# EasyEDA Pro project F103_RGB.eprj, schematic Schematic1
Board Name: Board1; Create Date: 2025-01-08; Page Name: P1; Project Name: F103_RGB; Schematic Name: Schematic1; Update Date: 2025-01-13; Company: 嘉立创EDA; Page Size: A4; Version: V1.0
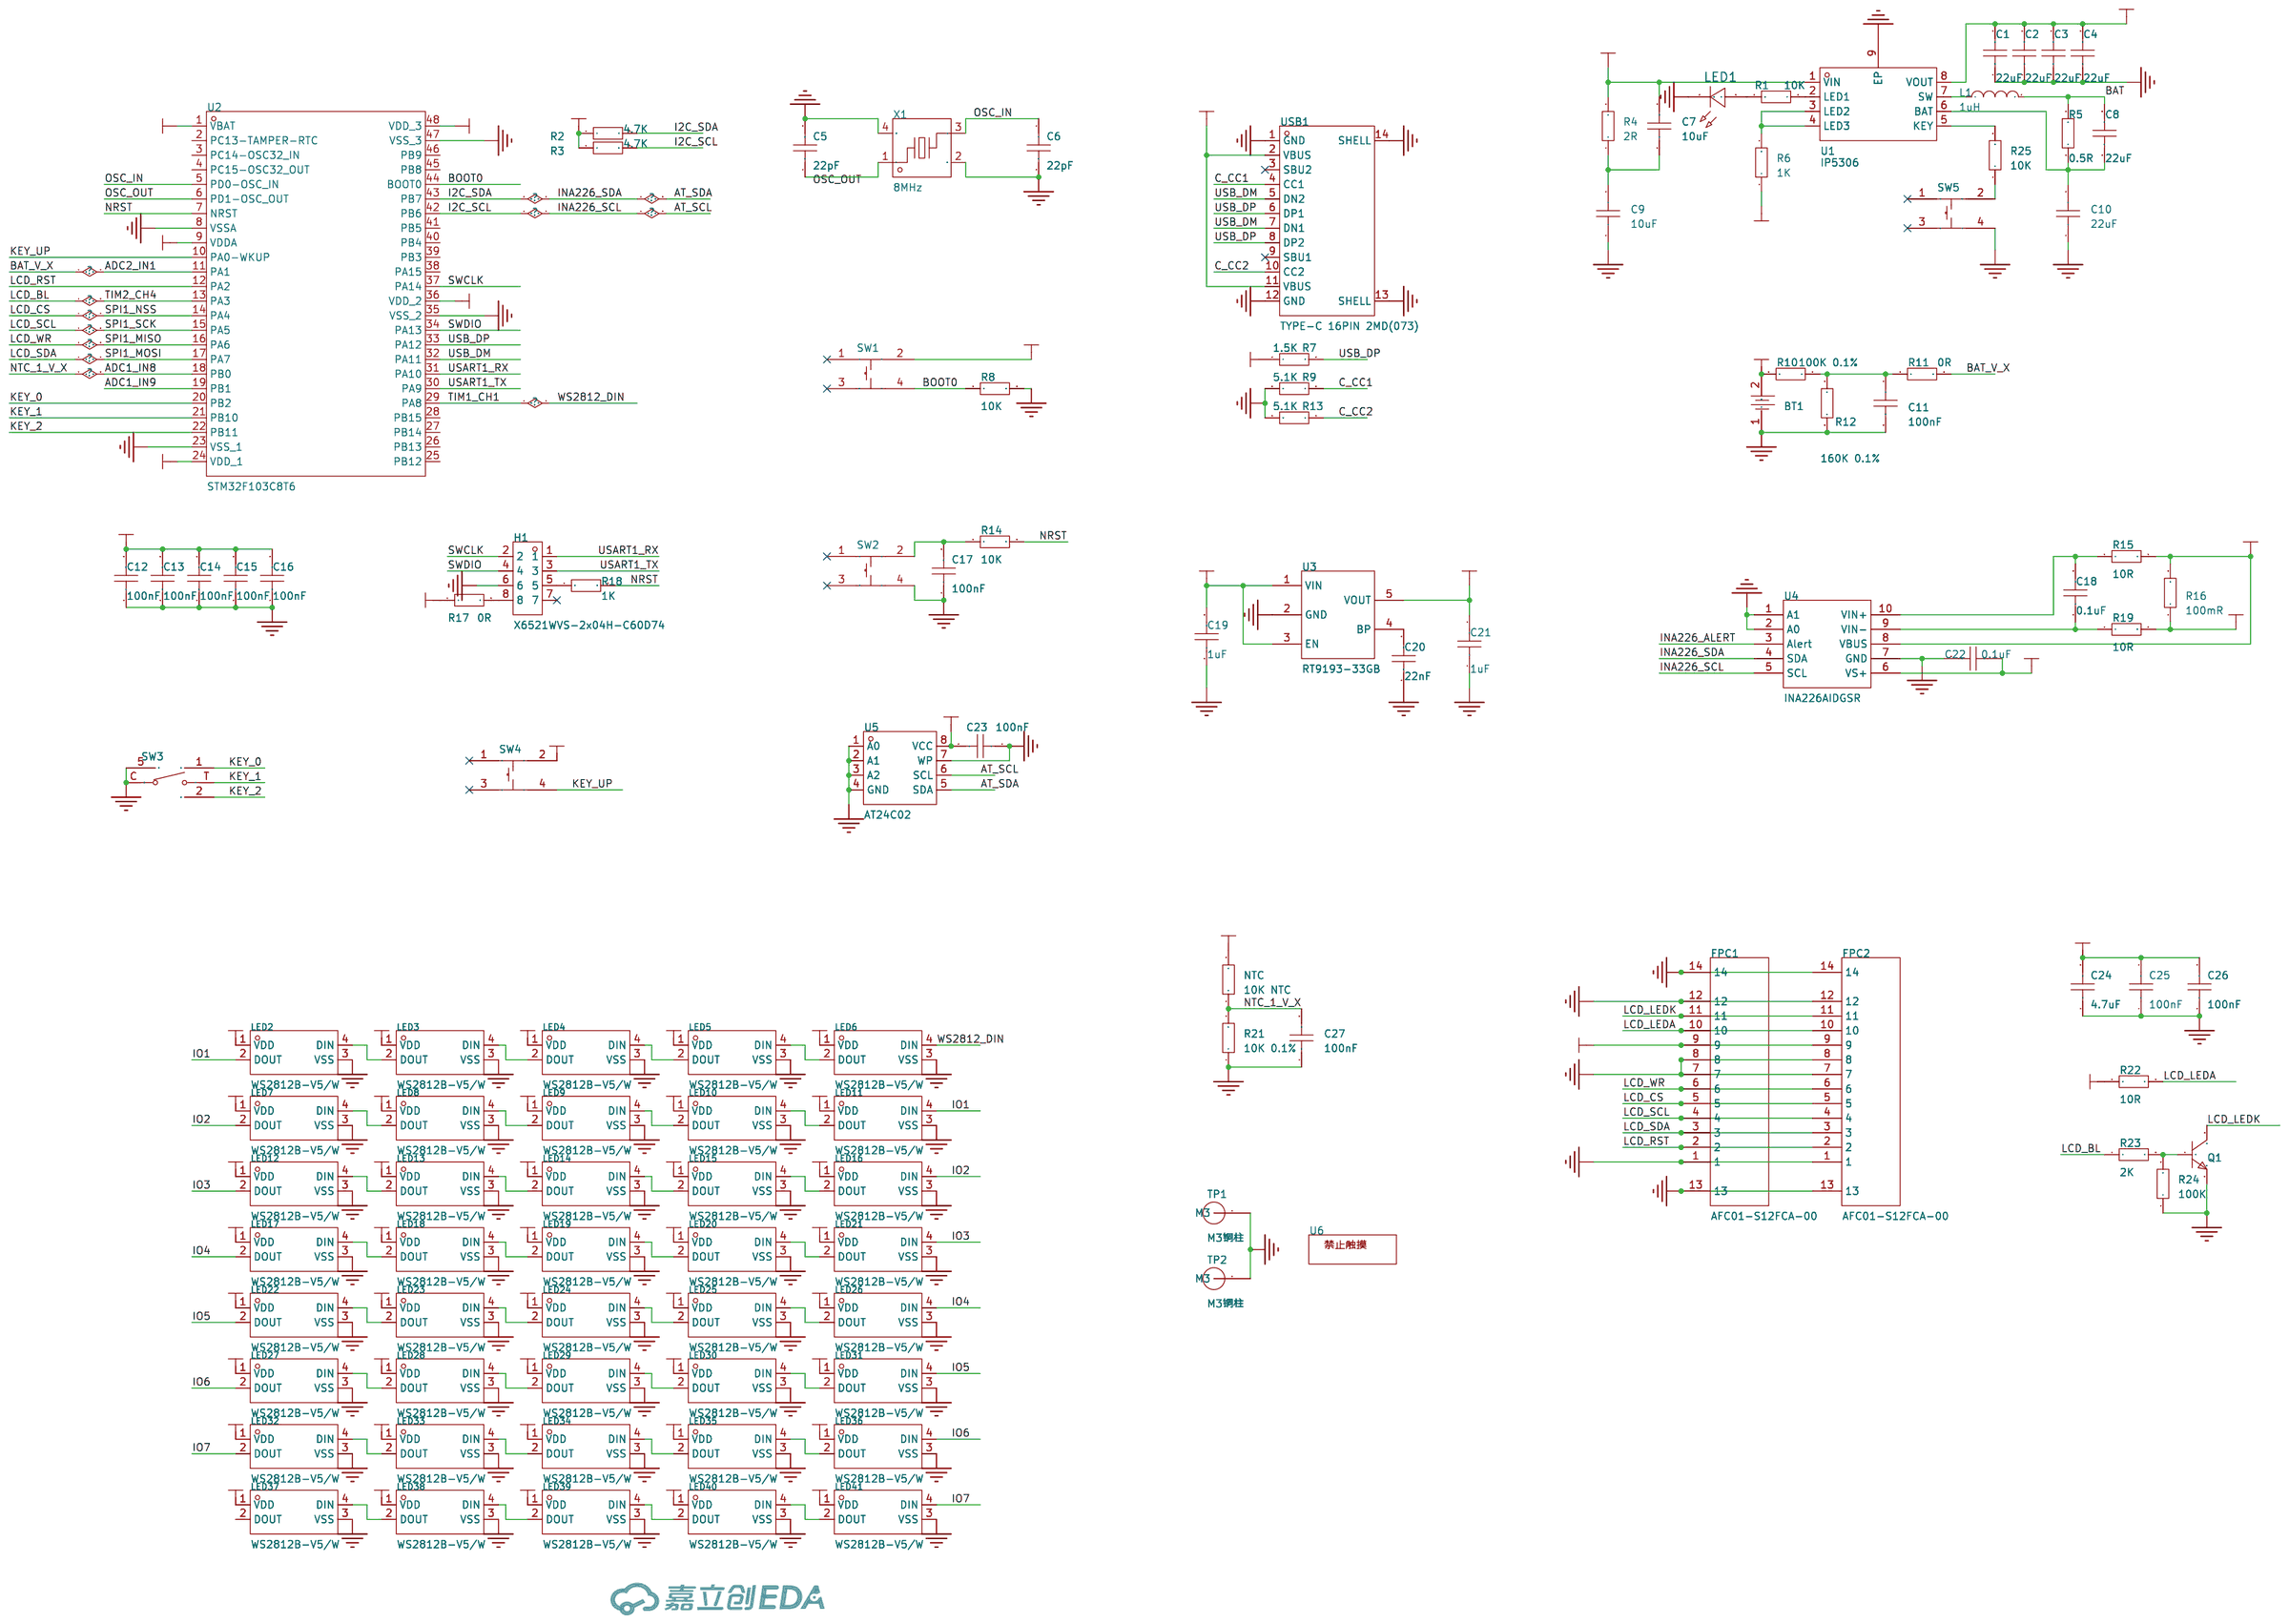
[diagram p0: schematic sheet]

## Parts
BT1  BH-18650-B1BA002  [BATTERY-SMD_18650-1S-L77.1-W20.7-1]
C1  22uF  [C0805]
C2  22uF  [C0805]
C3  22uF  [C0805]
C4  22uF  [C0805]
C5  22pF  [C0603]
C6  22pF  [C0603]
C7  10uF  [C0805]
C8  22uF  [C0805]
C9  10uF  [C0805]
C10  22uF  [C0805]
C11  100nF  [C0603]
C12  100nF  [C0603]
C13  100nF  [C0603]
C14  100nF  [C0603]
C15  100nF  [C0603]
C16  100nF  [C0603]
C17  100nF  [C0603]
C18  0.1uF  [C0603]
C19  1uF  [C0805]
C20  22nF  [C0603]
C21  1uF  [C0805]
C22  0.1uF  [C0603]
C23  100nF  [C0603]
C24  4.7uF  [C0603]
C25  100nF  [C0603]
C26  100nF  [C0603]
C27  100nF  [C0603]
FPC1  AFC01-S12FCA-00  [FPC-SMD_AFC01-S12FCA-00]
FPC2  AFC01-S12FCA-00  [FPC-SMD_AFC01-S12FCA-00]
H1  X6521WVS-2x04H-C60D74  [HDR-SMD_8P-P2.54-V-M-R2-C5-S7.4]
L1  1uH  [IND-SMD_L7.0-W7.0_HA63]
LED1  -  [LED_0603]
LED2  WS2812B-V5/W  [LED-SMD_4P-L5.0-W5.0-TL-1]
LED3  WS2812B-V5/W  [LED-SMD_4P-L5.0-W5.0-TL-1]
LED4  WS2812B-V5/W  [LED-SMD_4P-L5.0-W5.0-TL-1]
LED5  WS2812B-V5/W  [LED-SMD_4P-L5.0-W5.0-TL-1]
LED6  WS2812B-V5/W  [LED-SMD_4P-L5.0-W5.0-TL-1]
LED7  WS2812B-V5/W  [LED-SMD_4P-L5.0-W5.0-TL-1]
LED8  WS2812B-V5/W  [LED-SMD_4P-L5.0-W5.0-TL-1]
LED9  WS2812B-V5/W  [LED-SMD_4P-L5.0-W5.0-TL-1]
LED10  WS2812B-V5/W  [LED-SMD_4P-L5.0-W5.0-TL-1]
LED11  WS2812B-V5/W  [LED-SMD_4P-L5.0-W5.0-TL-1]
LED12  WS2812B-V5/W  [LED-SMD_4P-L5.0-W5.0-TL-1]
LED13  WS2812B-V5/W  [LED-SMD_4P-L5.0-W5.0-TL-1]
LED14  WS2812B-V5/W  [LED-SMD_4P-L5.0-W5.0-TL-1]
LED15  WS2812B-V5/W  [LED-SMD_4P-L5.0-W5.0-TL-1]
LED16  WS2812B-V5/W  [LED-SMD_4P-L5.0-W5.0-TL-1]
LED17  WS2812B-V5/W  [LED-SMD_4P-L5.0-W5.0-TL-1]
LED18  WS2812B-V5/W  [LED-SMD_4P-L5.0-W5.0-TL-1]
LED19  WS2812B-V5/W  [LED-SMD_4P-L5.0-W5.0-TL-1]
LED20  WS2812B-V5/W  [LED-SMD_4P-L5.0-W5.0-TL-1]
LED21  WS2812B-V5/W  [LED-SMD_4P-L5.0-W5.0-TL-1]
LED22  WS2812B-V5/W  [LED-SMD_4P-L5.0-W5.0-TL-1]
LED23  WS2812B-V5/W  [LED-SMD_4P-L5.0-W5.0-TL-1]
LED24  WS2812B-V5/W  [LED-SMD_4P-L5.0-W5.0-TL-1]
LED25  WS2812B-V5/W  [LED-SMD_4P-L5.0-W5.0-TL-1]
LED26  WS2812B-V5/W  [LED-SMD_4P-L5.0-W5.0-TL-1]
LED27  WS2812B-V5/W  [LED-SMD_4P-L5.0-W5.0-TL-1]
LED28  WS2812B-V5/W  [LED-SMD_4P-L5.0-W5.0-TL-1]
LED29  WS2812B-V5/W  [LED-SMD_4P-L5.0-W5.0-TL-1]
LED30  WS2812B-V5/W  [LED-SMD_4P-L5.0-W5.0-TL-1]
LED31  WS2812B-V5/W  [LED-SMD_4P-L5.0-W5.0-TL-1]
LED32  WS2812B-V5/W  [LED-SMD_4P-L5.0-W5.0-TL-1]
LED33  WS2812B-V5/W  [LED-SMD_4P-L5.0-W5.0-TL-1]
LED34  WS2812B-V5/W  [LED-SMD_4P-L5.0-W5.0-TL-1]
LED35  WS2812B-V5/W  [LED-SMD_4P-L5.0-W5.0-TL-1]
LED36  WS2812B-V5/W  [LED-SMD_4P-L5.0-W5.0-TL-1]
LED37  WS2812B-V5/W  [LED-SMD_4P-L5.0-W5.0-TL-1]
LED38  WS2812B-V5/W  [LED-SMD_4P-L5.0-W5.0-TL-1]
LED39  WS2812B-V5/W  [LED-SMD_4P-L5.0-W5.0-TL-1]
LED40  WS2812B-V5/W  [LED-SMD_4P-L5.0-W5.0-TL-1]
LED41  WS2812B-V5/W  [LED-SMD_4P-L5.0-W5.0-TL-1]
NTC  10K NTC  [R0603]
Q1  -  [S8050_SOT-23]
R1  10K  [R0603]
R2  4.7K  [R0603]
R3  4.7K  [R0603]
R4  2R  [R0603]
R5  0.5R  [R0603]
R6  1K  [R0603]
R7  1.5K  [R0603]
R8  10K  [R0603]
R9  5.1K  [R0603]
R10  100K 0.1%  [R0603]
R11  0R  [R0603]
R12  160K 0.1%  [R0603]
R13  5.1K  [R0603]
R14  10K  [R0603]
R15  10R  [R0603]
R16  100mR  [R1206]
R17  0R  [R0603]
R18  1K  [R0603]
R19  10R  [R0603]
R21  10K 0.1%  [R0603]
R22  10R  [R0603]
R23  2K  [R0603]
R24  100K  [R0603]
R25  10K  [R0603]
SW1  K2-1808SN-A3SW-01  [SW-SMD_4P-L4.2-W3.3-P2.15-LS5.1]
SW2  K2-1808SN-A3SW-01  [SW-SMD_4P-L4.2-W3.3-P2.15-LS5.1]
SW3  K1-1502SA-01  [KEY-SMD_K1-1502SA-01]
SW4  K2-1808SN-A3SW-01  [SW-SMD_4P-L4.2-W3.3-P2.15-LS5.1]
SW5  K2-1808SN-A3SW-01  [SW-SMD_4P-L4.2-W3.3-P2.15-LS5.1]
TP1  M3铜柱  [M3铜柱_LCEDA]
TP2  M3铜柱  [M3铜柱_LCEDA]
U1  IP5306  [ESOP-8_L4.9-W3.9-P1.27-LS6.0-BL-EP]
U2  STM32F103C8T6  [LQFP-48_L7.0-W7.0-P0.50-LS9.0-BL]
U3  RT9193-33GB  [SOT-23-5_L3.0-W1.7-P0.95-LS2.8-BL]
U4  INA226AIDGSR  [MSOP-10_L3.0-W3.0-P0.50-LS5.0-BL]
U5  AT24C02  [SOP-8_L5.0-W4.0-P1.27-LS6.0-BL]
U6  -  [禁止触摸LOGO]
USB1  TYPE-C 16PIN 2MD(073)  [USB-C-SMD_TYPE-C-6PIN-2MD-073]
X1  8MHz  [OSC-SMD_4P-L3.2-W2.5-BL]

## Library data of the parts
BT1 = BH-18650-B1BA002: LCSC Part Name: 电池盒 适用电池:18650; Supplier Part: C2988620; Manufacturer: MYOUNG(美阳); Supplier Footprint: SMD; JLCPCB Part Class: 扩展库; Datasheet: https://atta.szlcsc.com/upload/public/pdf/source/20220402/870DB99AB50CA0DF8D51CF7C86A51FAB.pdf; Supplier: LCSC; Connector Type: 电池盒; Battery Type: 18650
C1-C18 C20 C22-C27 = CAP_0603: Supplier Footprint: 0603
C19 C21 = CAP_0805: Supplier Footprint: 0805
FPC1 FPC2 = AFC01-S12FCA-00: LCSC Part Name: 间距:0.5mm P数:12P 翻盖式 下接; Supplier Part: C262661; Manufacturer: JS(钜硕电子); Supplier Footprint: SMD,P=0.5mm,卧贴; JLCPCB Part Class: 扩展库; Datasheet: https://atta.szlcsc.com/upload/public/pdf/source/20190816/C413942_2A72D1AC756EAE17EEDF756A339D4500.pdf; Supplier: LCSC; Locking Feature: 翻盖式; Contact Type: 下接; Number of Contacts: 12P; Pitch: 0.5mm; Mounting Type: 卧贴; FFC, FCB Thickness: 0.3mm; Height Above Board: 2mm
H1 = X6521WVS-2x04H-C60D74: LCSC Part Name: 2x4P 间距:2.54mm 方针; Supplier Part: C780053; Manufacturer: XKB Connection(中国星坤); Supplier Footprint: SMD,P=2.54mm; JLCPCB Part Class: 扩展库; Datasheet: https://atta.szlcsc.com/upload/public/pdf/source/20211009/E3239EE5247E6BAFECB8B74A4FCF9AB8.pdf; Supplier: LCSC; Pin Structure: 2x4P; Pitch: 2.54mm; Row Spacing: 2.54mm; Circluar Pins/Square Pins: 方针; Number of Rows: 双排; Number of Pins: 8P; Current Rating (Max): 3A; Voltage Rating (Max): 250V; Insulation Height: 2.5mm; Contact Material: 黄铜; Contact Plating: 金; Operating Temperature Range: -40℃~+105℃; Soldering Temperature(Max): 260℃; Color: 黑色
L1 = HA63-220MT: 电感值:22uH;精度:±20%;额定电流:2.5A;饱和电流(Isat):3A;; LCSC Part Name: 22uH ±20% 2.5A 150mΩ; Supplier Part: C2936660; Manufacturer: FH(风华); Supplier Footprint: 0630; JLCPCB Part Class: Extended Part; Datasheet: https://atta.szlcsc.com/upload/public/pdf/source/20211228/DF5AAD1C624D1DACD739A51BD94418BC.pdf; Supplier: LCSC; Tolerance: ±20%; Rated Current: 2.5A; Saturation Current (Isat): 3A; DC Resistance (DCR): 150mΩ
LED1 = LED_0603-R: Supplier Footprint: 0603
LED2-LED41 = WS2812B-V5/W: 无需外围元器件，有反接保护和过压保护，游乐设备，消费类电子，电竞领域，电脑周边及设备; LCSC Part Name: RGB三色 （注意防潮，请查阅规格书中对应具体内容）; Supplier Part: C2874885; Manufacturer: worldsemi; Supplier Footprint: SMD5050; JLCPCB Part Class: Extended Part; Datasheet: https://atta.szlcsc.com/upload/public/pdf/source/20220607/7C249E7978D02183621563743847A955.pdf; Supplier: LCSC
NTC R1-R15 R17-R19 R21-R25 = Res_0603: Supplier Footprint: 0603
Q1 = S8050_SOT_NPN: Supplier Footprint: SOT-23
R16 = Res_1206: Supplier Footprint: 1206
SW1 SW2 SW4 SW5 = K2-1808SN-A3SW-01: 触点电流:50mA;额定电压(DC):12V;绝缘电阻:100MΩ;安装方式:立贴;作用力:180gf@±30gf;机械寿命:100000;工作温度:-25℃~+85℃;开关长度:4.2mm;开关宽度:3.25mm;开关高度:2.5mm;; LCSC Part Name: 3*4*2.5 贴片开关180G; Supplier Part: C2690012; Manufacturer: 韩国韩荣; Supplier Footprint: SMD; JLCPCB Part Class: Extended Part; Datasheet: https://atta.szlcsc.com/upload/public/pdf/source/20180927/C283535_7E7907F3E7B6C1691E1DC87E363D082A.pdf; Supplier: LCSC; Contact Current: 50mA; Voltage Rating (DC): 12V; Insulation Resistance: 100MΩ; Mounting Sytle: 立贴; Operating Force: 180gf@±30gf; Mechanical Life: 100000; Operating Temperature: -25℃~+85℃; Switch Length: 4.2mm; Switch Width: 3.25mm; Switch Height: 2.5mm
SW3 = K1-1502SA-01: Supplier Part: C145915; Manufacturer: 韩国韩荣; Supplier Footprint: 12.4*11.8mm; JLCPCB Part Class: 扩展库; Datasheet: https://atta.szlcsc.com/upload/public/pdf/source/20210810/68556D289DEA90EEE2C9C67C3CF0D02D.pdf; Supplier: LCSC
TP1 TP2 = M3铜柱: Supplier: LCSC
U1 = IP5306: 2.1A充电2.4A放电高集成度移动电源SOC; Supplier Part: C181692; Manufacturer: INJOINIC(英集芯); Supplier Footprint: ESOP-8; JLCPCB Part Class: 扩展库; Datasheet: https://atta.szlcsc.com/upload/public/pdf/source/20180920/C181692_842C9BF636DF123BB66E91FC1AD6F13F.pdf; Supplier: LCSC
U2 = STM32F103C8T6: LCSC Part Name: 主流增强型ARM Cortex-M3 MCU，具有64 KB Flash、72 MHz CPU、电机控制、USB和CAN; Supplier Part: C8734; Manufacturer: ST(意法半导体); Supplier Footprint: LQFP-48(7x7); JLCPCB Part Class: 扩展库; Datasheet: https://atta.szlcsc.com/upload/public/pdf/source/20220812/8363ACEC51AD55ECEB84799464F7CB85.pdf; Supplier: LCSC; CPU Core: ARM-M3; CPU Maximum Speed: 72MHz; Program Storage Size: 64KB; Program Memory Type: FLASH; GPIO Ports Number: 37; ADC (Bit): 12bit; Low Voltage Detection Threshold: 2V~3.6V
U3 = RT9193-33GB: LCSC Part Name: 输入5.5V 输出3.3V 300mA; Supplier Part: C15651; Manufacturer: RICHTEK(立锜); Supplier Footprint: SOT-23-5; JLCPCB Part Class: 扩展库; Datasheet: https://atta.szlcsc.com/upload/public/pdf/source/20130730/1457706628575.pdf; Supplier: LCSC; Output Type: 固定; Maximum Input Voltage: 5.5V; Output Voltage: 3.3V; Output Current: 300mA; Power Supply Rejection Ratio (PSRR): 70dB@(100Hz)；50dB@(10kHz); Dropout Voltage: 300mV@(300mA); standby current: 130uA; Feature: 防静电保护；低ESR；热保护(TSD)；过流保护(OCP)；带使能; Operating Temperature: -40℃~+125℃; Output Polarity: 正极; Number of Outputs: 1
U4 = INA226AIDGSR: INA226 支持报警功能的 36V、双向、超高精度、低侧/高侧、I2C 输出电流/功率监控器; Supplier Part: C49851; Manufacturer: TI(德州仪器); Supplier Footprint: MSOP-10; JLCPCB Part Class: 扩展库; Datasheet: https://www.ti.com/cn/lit/gpn/ina226; Supplier: LCSC; Supply Voltage: 0V~36V; Operating Temperature: -40℃~+125℃
U5 = AT24C02_C688857: LCSC Part Name: 24C02 2Kbit电可擦除PROM; Supplier Part: C688857; Manufacturer: IDCHIP(英锐芯); Supplier Footprint: SOP-8; JLCPCB Part Class: 扩展库; Datasheet: https://atta.szlcsc.com/upload/public/pdf/source/20200619/C688857_168265888F77B455D6D4136881F4BB15.pdf; Supplier: LCSC
U6 = 禁止触摸LOGO
USB1 = TYPE-C 16PIN 2MD(073): LCSC Part Name: Type-C 母 卧贴; Supplier Part: C2765186; Manufacturer: SHOU HAN(首韩); Supplier Footprint: SMD; JLCPCB Part Class: 扩展库; Datasheet: https://atta.szlcsc.com/upload/public/pdf/source/20211123/39B17C16241EAC15C5E277BDA434118E.pdf; Supplier: LCSC; Connector Type: Type-C; Standard: USB 3.1; Gender: 母; Mounting Style: 卧贴; Number of Contacts: 16P; Number of Ports: 1; Current Rating - Power (Max): 5A; Operating Temperature Range: -25℃~+85℃; Rated Voltage (Max): 5V; Connect-Disconnect Life: 5千次; Core Colour: 黑色
X1 = X32258MOB4SI: 晶振类型:贴片晶振;频率:8MHz;常温频差:±10ppm;外接负载电容:12pF;频率稳定度(全温):±20ppm;; LCSC Part Name: 8MHz ±10ppm 12pF; Supplier Part: C2682775; Manufacturer: YXC(扬兴晶振); Supplier Footprint: SMD3225-4P; JLCPCB Part Class: 扩展库; Datasheet: https://atta.szlcsc.com/upload/public/pdf/source/20240329/19D5F850207469550BEB00D7DFEDBC7A.pdf; Supplier: LCSC; Crystal Type: 贴片晶振; Normal temperature Frequency Tolerance: ±10ppm; External load capacitor: 12pF; Frequency Stability(Full temperature range): ±20ppm; Equivalent Series Resistance (ESR): 150Ω; Operating Temperature: -40℃~+85℃

## Nets
3V3: C12.2 C13.2 C14.2 C15.2 C16.2 C21.2 C22.2 C23.2 C24.2 C25.2 C26.2 FPC1.9 FPC2.9 NTC.2 R2.1 R3.1 R7.1 R22.1 SW1.2 SW4.2 U2.1(VBAT) U2.9(VDDA) U2.24(VDD_1) U2.36(VDD_2) U2.48(VDD_3) U3.5(VOUT) U4.6(VS+) U5.8(VCC)
5V: C19.2 LED2.1(VDD) LED3.1(VDD) LED4.1(VDD) LED5.1(VDD) LED6.1(VDD) LED7.1(VDD) LED8.1(VDD) LED9.1(VDD) LED10.1(VDD) LED11.1(VDD) LED12.1(VDD) LED13.1(VDD) LED14.1(VDD) LED15.1(VDD) LED16.1(VDD) LED17.1(VDD) LED18.1(VDD) LED19.1(VDD) LED20.1(VDD) LED21.1(VDD) LED22.1(VDD) LED23.1(VDD) LED24.1(VDD) LED25.1(VDD) LED26.1(VDD) LED27.1(VDD) LED28.1(VDD) LED29.1(VDD) LED30.1(VDD) LED31.1(VDD) LED32.1(VDD) LED33.1(VDD) LED34.1(VDD) LED35.1(VDD) LED36.1(VDD) LED37.1(VDD) LED38.1(VDD) LED39.1(VDD) LED40.1(VDD) LED41.1(VDD) R16.1 R17.1 R19.2 U3.1(VIN) U3.3(EN)
5V_VBUS: C1.2 C2.2 C3.2 C4.2 R15.2 R16.2 U1.8(VOUT) U4.8(VBUS)
GND: BT1.1 C1.1 C2.1 C3.1 C4.1 C5.2 C6.2 C9.1 C10.1 C11.2 C12.1 C13.1 C14.1 C15.1 C16.1 C17.1 C19.1 C20.1 C21.1 C22.1 C23.1 C24.1 C25.1 C26.1 C27.1 FPC1.1 FPC1.7 FPC1.8 FPC1.12 FPC1.13 FPC1.14 FPC2.1 FPC2.7 FPC2.8 FPC2.12 FPC2.13 FPC2.14 H1.6 LED1.1(C) LED2.3(VSS) LED3.3(VSS) LED4.3(VSS) LED5.3(VSS) LED6.3(VSS) LED7.3(VSS) LED8.3(VSS) LED9.3(VSS) LED10.3(VSS) LED11.3(VSS) LED12.3(VSS) LED13.3(VSS) LED14.3(VSS) LED15.3(VSS) LED16.3(VSS) LED17.3(VSS) LED18.3(VSS) LED19.3(VSS) LED20.3(VSS) LED21.3(VSS) LED22.3(VSS) LED23.3(VSS) LED24.3(VSS) LED25.3(VSS) LED26.3(VSS) LED27.3(VSS) LED28.3(VSS) LED29.3(VSS) LED30.3(VSS) LED31.3(VSS) LED32.3(VSS) LED33.3(VSS) LED34.3(VSS) LED35.3(VSS) LED36.3(VSS) LED37.3(VSS) LED38.3(VSS) LED39.3(VSS) LED40.3(VSS) LED41.3(VSS) Q1.2 R8.2 R9.2 R12.2 R13.2 R21.1 R24.1 SW2.4 SW3.5 SW3.C SW5.4 TP1.1(M3) TP2.1(M3) U1.9(EP) U2.8(VSSA) U2.23(VSS_1) U2.35(VSS_2) U2.47(VSS_3) U3.2(GND) U4.1(A1) U4.2(A0) U4.7(GND) U5.1(A0) U5.2(A1) U5.3(A2) U5.4(GND) U5.7(WP) USB1.1(GND) USB1.12(GND) USB1.13(SHELL) USB1.14(SHELL) X1.2(GND) X1.4(GND)
VBUS: C7.2 R4.2 U1.1(VIN) USB1.2(VBUS) USB1.11(VBUS)
ADC1_IN8: C27.2 NTC.1 R21.2 U2.18(PB0)
ADC1_IN9: U2.19(PB1)
ADC2_IN1: R11.2 U2.11(PA1)
AT_SCL: R3.2 U2.42(PB6) U4.5(SCL) U5.6(SCL)
AT_SDA: R2.2 U2.43(PB7) U4.4(SDA) U5.5(SDA)
BAT: BT1.2 C8.2 L1.2 R5.2 R6.1 R10.2
BOOT0: R8.1 SW1.4 U2.44(BOOT0)
C_CC1: R9.1 USB1.4(CC1)
C_CC2: R13.1 USB1.10(CC2)
INA226_ALERT: U4.3(Alert)
IO1: LED2.2(DOUT) LED11.4(DIN)
IO2: LED7.2(DOUT) LED16.4(DIN)
IO3: LED12.2(DOUT) LED21.4(DIN)
IO4: LED17.2(DOUT) LED26.4(DIN)
IO5: LED22.2(DOUT) LED31.4(DIN)
IO6: LED27.2(DOUT) LED36.4(DIN)
IO7: LED32.2(DOUT) LED41.4(DIN)
KEY_0: SW3.1 U2.20(PB2)
KEY_1: SW3.T U2.21(PB10)
KEY_2: SW3.2 U2.22(PB11)
KEY_UP: SW4.4 U2.10(PA0-WKUP)
LCD_BL: R23.1 U2.13(PA3)
LCD_CS: FPC1.5 FPC2.5 U2.14(PA4)
LCD_LEDA: FPC1.10 FPC2.10 R22.2
LCD_LEDK: FPC1.11 FPC2.11 Q1.3
LCD_RST: FPC1.2 FPC2.2 U2.12(PA2)
LCD_SCL: FPC1.4 FPC2.4 U2.15(PA5)
LCD_SDA: FPC1.3 FPC2.3 U2.17(PA7)
LCD_WR: FPC1.6 FPC2.6 U2.16(PA6)
NRST: R14.2 R18.2 U2.7(NRST)
OSC_IN: C6.1 U2.5(PD0-OSC_IN) X1.3
OSC_OUT: C5.1 U2.6(PD1-OSC_OUT) X1.1
SWCLK: H1.2 U2.37(PA14)
SWDIO: H1.4 U2.34(PA13)
TIM1_CH1: LED6.4(DIN) U2.29(PA8)
USART1_RX: H1.1 U2.31(PA10)
USART1_TX: H1.3 U2.30(PA9)
USB_DM: U2.32(PA11) USB1.5(DN2) USB1.7(DN1)
USB_DP: R7.2 U2.33(PA12) USB1.6(DP1) USB1.8(DP2)
$1N1297: LED5.4(DIN) LED6.2(DOUT)
$1N1298: LED4.4(DIN) LED5.2(DOUT)
$1N1299: LED3.4(DIN) LED4.2(DOUT)
$1N1300: LED2.4(DIN) LED3.2(DOUT)
$1N1311: LED10.4(DIN) LED11.2(DOUT)
$1N1312: LED9.4(DIN) LED10.2(DOUT)
$1N1313: LED8.4(DIN) LED9.2(DOUT)
$1N1314: LED7.4(DIN) LED8.2(DOUT)
$1N1325: LED15.4(DIN) LED16.2(DOUT)
$1N1326: LED14.4(DIN) LED15.2(DOUT)
$1N1327: LED13.4(DIN) LED14.2(DOUT)
$1N1328: LED12.4(DIN) LED13.2(DOUT)
$1N1339: LED20.4(DIN) LED21.2(DOUT)
$1N1340: LED19.4(DIN) LED20.2(DOUT)
$1N1341: LED18.4(DIN) LED19.2(DOUT)
$1N1342: LED17.4(DIN) LED18.2(DOUT)
$1N2561: LED38.4(DIN) LED39.2(DOUT)
$1N2563: LED39.4(DIN) LED40.2(DOUT)
$1N2569: LED40.4(DIN) LED41.2(DOUT)
$1N2574: LED24.4(DIN) LED25.2(DOUT)
$1N2575: LED25.4(DIN) LED26.2(DOUT)
$1N2577: LED30.4(DIN) LED31.2(DOUT)
$1N2580: LED29.4(DIN) LED30.2(DOUT)
$1N2582: LED28.4(DIN) LED29.2(DOUT)
$1N2586: LED23.4(DIN) LED24.2(DOUT)
$1N2588: LED32.4(DIN) LED33.2(DOUT)
$1N2592: LED27.4(DIN) LED28.2(DOUT)
$1N2599: LED35.4(DIN) LED36.2(DOUT)
$1N2602: LED33.4(DIN) LED34.2(DOUT)
$1N2608: LED34.4(DIN) LED35.2(DOUT)
$1N2613: LED22.4(DIN) LED23.2(DOUT)
$1N2624: LED37.4(DIN) LED38.2(DOUT)
$1N5283: C7.1 C9.2 R4.1
$1N5287: R6.2 U1.3(LED2) U1.4(LED3)
$1N5290: C8.1 C10.2 R5.1 U1.6(BAT)
$1N5292: L1.1 U1.7(SW)
$1N5305: C11.1 R10.1 R11.1 R12.1
$1N6451: C17.2 R14.1 SW2.2
$1N9042: Q1.1 R23.2 R24.2
$1N12485: C18.2 R15.1 U4.10(VIN+)
$1N12486: C18.1 R19.1 U4.9(VIN-)
$1N16092: C20.2 U3.4(BP)
$1N16325: R1.1 U1.2(LED1)
$1N16327: LED1.2(A) R1.2
$1N16424: H1.5 R18.1
$1N16426: H1.8 R17.2
$1N30459: R25.1 SW5.2
$1N30463: R25.2 U1.5(KEY)

Not connected (* = marked no-connect by the designer): H1 7*; LED37 2(DOUT); SW1 1* 3*; SW2 1* 3*; SW4 1* 3*; SW5 1* 3*; U2 2(PC13-TAMPER-RTC) 3(PC14-OSC32_IN) 4(PC15-OSC32_OUT) 25(PB12) 26(PB13) 27(PB14) 28(PB15) 38(PA15) 39(PB3) 40(PB4) 41(PB5) 45(PB8) 46(PB9); USB1 3(SBU2)* 9(SBU1)*
